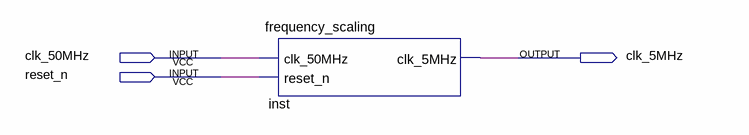
[diagram p0: schematic sheet]
// Quartus schematic fs.bdf as structural Verilog: 1 symbols, 3 pins
module fs (
  input  clk_50MHz,
  input  reset_n,
  output clk_5MHz
);

  frequency_scaling inst (.clk_50MHz(clk_50MHz), .reset_n(reset_n), .clk_5MHz(clk_5MHz));
endmodule
